# EAGLE design led (EAGLE 7.1.0)
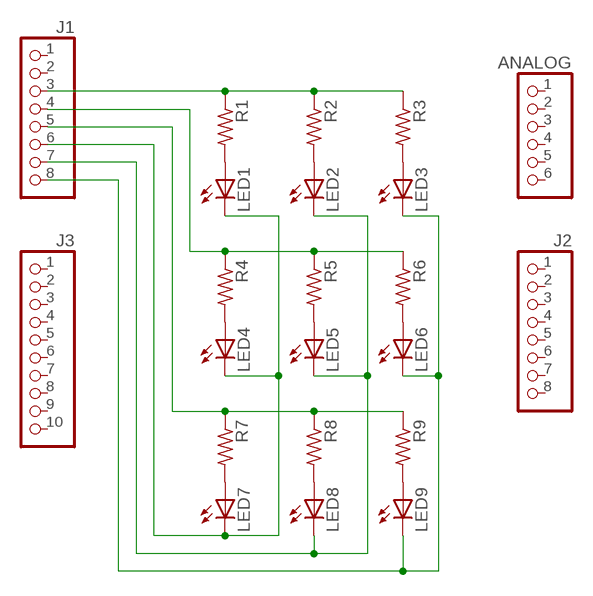
[diagram p0: schematic, sheet 1]

## Parts
ANALOG  PINHD-1X6  [1X06]
J1  PINHD-1X8TH  [1X08-TH]
J2  PINHD-1X8TH  [1X08-TH]
J3  PINHD-1X10TH  [1X10-TH]
LED1  LED3MM  [LED3MM]
LED2  LED3MM  [LED3MM]
LED3  LED3MM  [LED3MM]
LED4  LED3MM  [LED3MM]
LED5  LED3MM  [LED3MM]
LED6  LED3MM  [LED3MM]
LED7  LED3MM  [LED3MM]
LED8  LED3MM  [LED3MM]
LED9  LED3MM  [LED3MM]
R1  R-US_0207/10  [0207/10]
R2  R-US_0207/10  [0207/10]
R3  R-US_0207/10  [0207/10]
R4  R-US_0207/10  [0207/10]
R5  R-US_0207/10  [0207/10]
R6  R-US_0207/10  [0207/10]
R7  R-US_0207/10  [0207/10]
R8  R-US_0207/10  [0207/10]
R9  R-US_0207/10  [0207/10]

## Nets
N$1: LED1.A R1.2
N$2: LED2.A R2.2
N$3: LED3.A R3.2
N$4: LED4.A R4.2
N$5: LED5.A R5.2
N$6: LED6.A R6.2
N$7: LED7.A R7.2
N$8: LED8.A R8.2
N$9: LED9.A R9.2
N$10: J1.3 R1.1 R2.1 R3.1
N$14: J1.6 LED1.K(C) LED4.K(C) LED7.K(C)
N$15: J1.7 LED2.K(C) LED5.K(C) LED8.K(C)
N$16: J1.8 LED3.K(C) LED6.K(C) LED9.K(C)
N$17: J1.4 R4.1 R5.1 R6.1
N$18: J1.5 R7.1 R8.1 R9.1
Unconnected: ANALOG.1 ANALOG.2 ANALOG.3 ANALOG.4 ANALOG.5 ANALOG.6 J1.1 J1.2 J2.1 J2.2 J2.3 J2.4 J2.5 J2.6 J2.7 J2.8 J3.1 J3.2 J3.3 J3.4 J3.5 J3.6 J3.7 J3.8 J3.9 J3.10

## Library data of the parts
ANALOG = pinhead:PINHD-1X6: PIN HEADER
J1 J2 = SmartPrj:PINHD-1X8: PIN HEADER
J3 = SmartPrj:PINHD-1X10: PIN HEADER
LED1-LED9 = led:LED: LED OSRAM: - CHIPLED LG R971, LG N971, LY N971, LG Q971, LY Q971, LO R971, LY R971 LH N974, LH R974 LS Q976, LO Q976, LY Q976 LO Q996 - Hyper CHIPLED LW Q18S LB Q993, LB Q99A, LB R99A - SideLED LS A670, LO A670, LY A670, LG A670, LP A670 LB A673, LV A673, LT A673, LW A673 LH A674 LY A675 LS A676, LA A676, LO A676, LY A676, LW A676 LS A679, LY A679, LG A679 - Hyper Micro SIDELED® LS Y876, LA Y876, LO Y876, LY Y876 LT Y87S - SmartLED LW L88C, LW L88S LB L89C, LB L89S, LG L890 LS L89K, LO L89K, LY L89K LS L896, LA L896, LO L896, LY L896 - TOPLED LS T670, LO T670, LY T670, LG T670, LP T670 LSG T670, LSP T670, LSY T670, LOP T670, LYG T670 LG T671, LOG T671, LSG T671 LB T673, LV T673, LT T673, LW T673 LH T674 LS T676, LA T676, LO T676, LY T676, LB T676, LH T676, LSB T676, LW T676 LB T67C, LV T67C, LT T67C, LS T67K, LO T67K, LY T67K, LW E67C LS E67B, LA E67B, LO E67B, LY E67B, LB E67C, LV E67C, LT E67C LW T67C LS T679, LY T679, LG T679 LS T770, LO T770, LY T770, LG T770, LP T770 LB T773, LV T773, LT T773, LW T773 LH T774 LS E675, LA E675, LY E675, LS T675 LS T776, LA T776, LO T776, LY T776, LB T776 LHGB T686 LT T68C, LB T68C - Hyper Mini TOPLED® LB M676 - Mini TOPLED Santana® LG M470 LS M47K, LO M47K, LY M47K Source: http://www.osram.convergy.de LUXEON: - LUMILED® LXK2-PW12-R00, LXK2-PW12-S00, LXK2-PW14-U00, LXK2-PW14-V00 LXK2-PM12-R00, LXK2-PM12-S00, LXK2-PM14-U00 LXK2-PE12-Q00, LXK2-PE12-R00, LXK2-PE12-S00, LXK2-PE14-T00, LXK2-PE14-U00 LXK2-PB12-K00, LXK2-PB12-L00, LXK2-PB12-M00, LXK2-PB14-N00, LXK2-PB14-P00, LXK2-PB14-Q00 LXK2-PR12-L00, LXK2-PR12-M00, LXK2-PR14-Q00, LXK2-PR14-R00 LXK2-PD12-Q00, LXK2-PD12-R00, LXK2-PD12-S00 LXK2-PH12-R00, LXK2-PH12-S00 LXK2-PL12-P00, LXK2-PL12-Q00, LXK2-PL12-R00 Source: www.luxeon.com KINGBRIGHT: KA-3528ASYC Source: www.kingbright.com
R1-R9 = resistor:R-US_: RESISTOR, American symbol

## Board
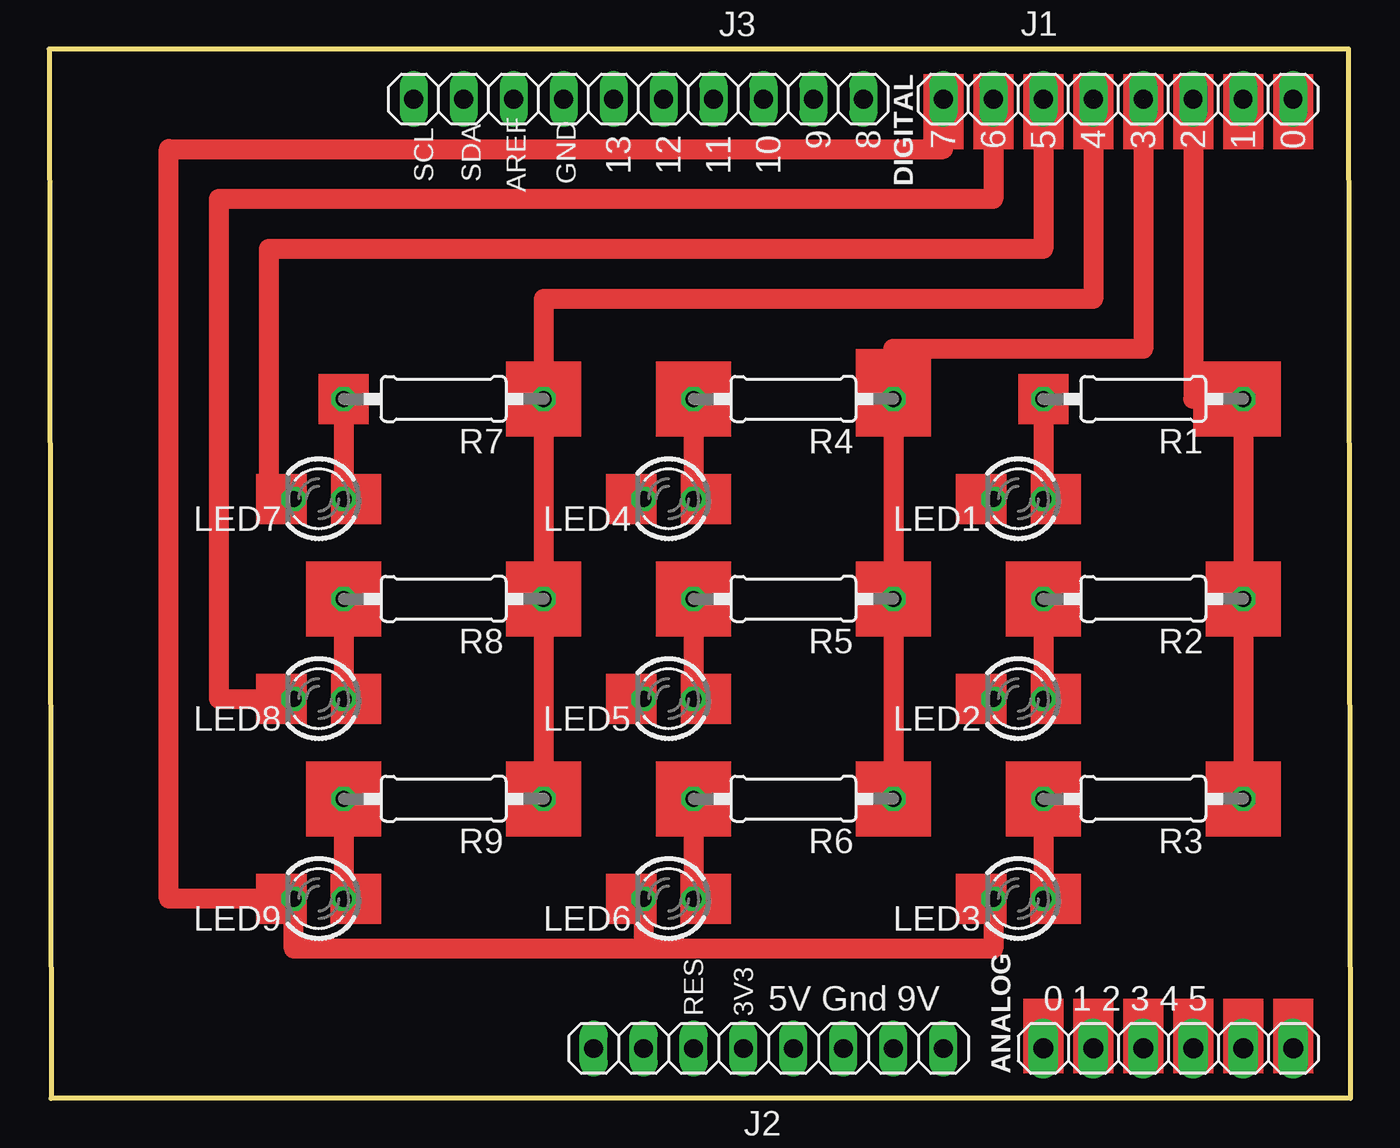
[diagram p1: board, top side]
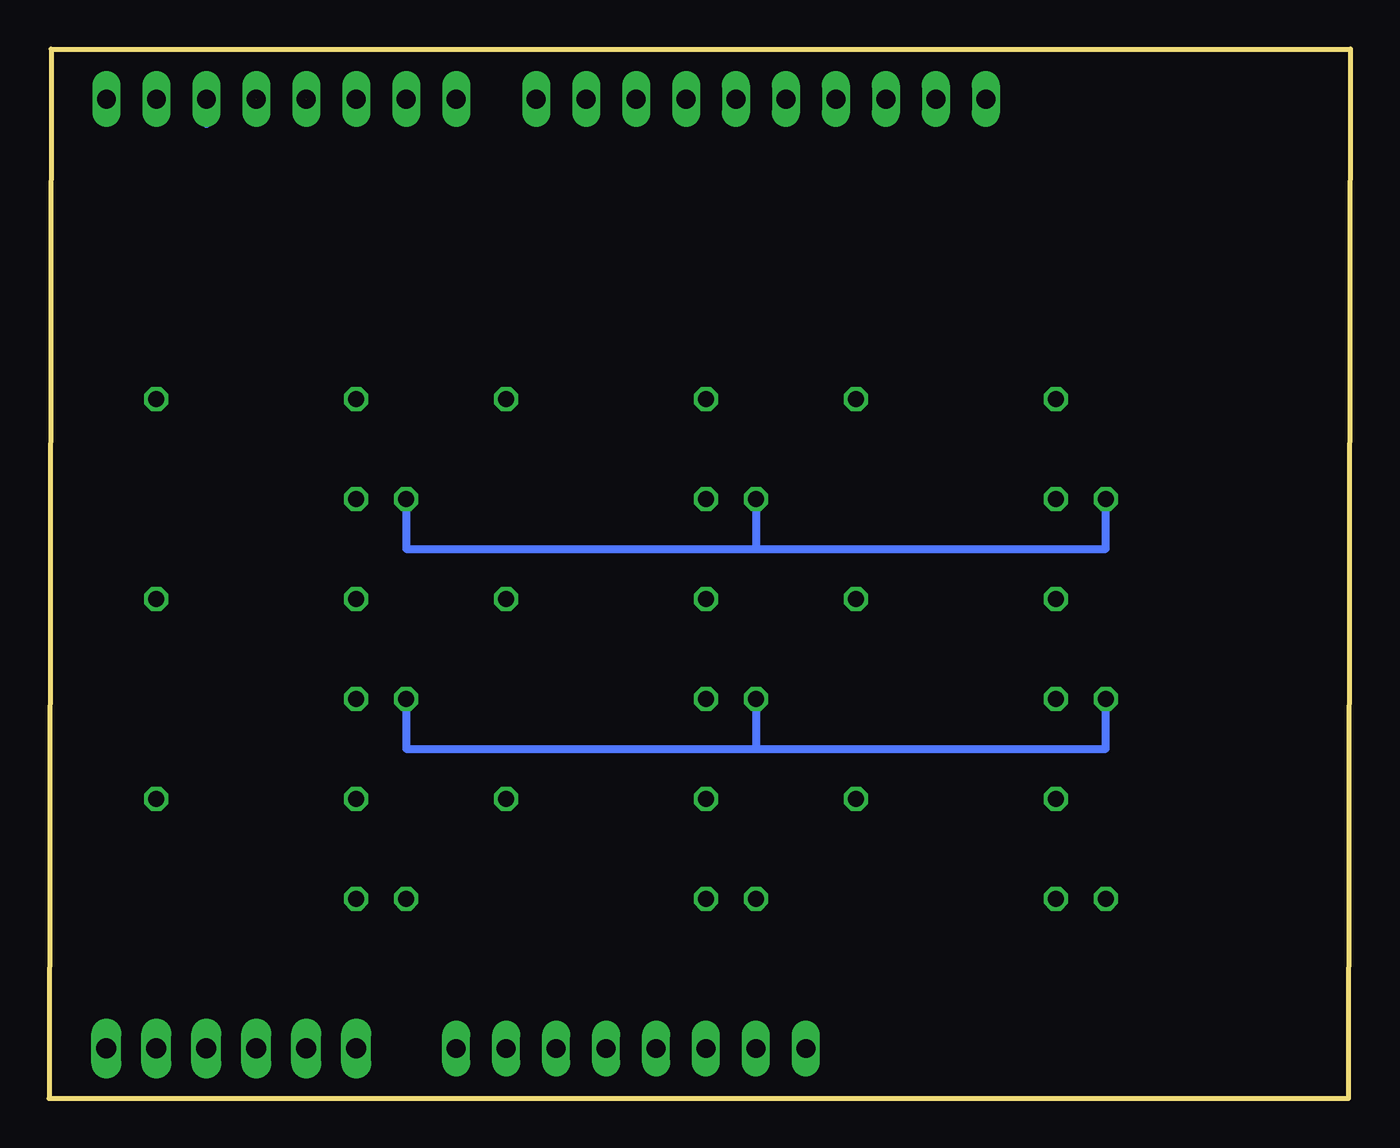
[diagram p2: board, bottom side, seen from below]

Size 66.14 x 53.34 mm. Coordinates in mm from the lower left corner, seen from the top.
Outline: 66.14,0 0.09,0 0,53.34 66.04,53.34 66.14,0
Copper layers (1*16): Top 0.035mm / dielectric 1.53mm / Bottom 0.035mm
Design rules "pban_4mil-l2": minimum track width 0.1mm, minimum drill 0.3mm, track to track 0.1mm, track to pad 0.229mm, pad to pad 0.1mm, via to via 0.1mm, smd to smd 0.1mm, copper to edge 0.5mm, drill to drill 0.5mm, minimum pad ring 0.15mm, minimum via ring 0.15mm, stop-mask expansion 4mil, vias tented up to drill 0.35mm, thermal gap 10mil

### Footprints (pad centres in the part's own frame; a part is rotated, then mirrored left to right if it is on the bottom)
1X06 = drill 1.016 long: 1 -6.35,0; 2 -3.81,0; 3 -1.27,0; 4 1.27,0; 5 3.81,0; 6 6.35,0
1X08-TH = drill 0.95 pad 1.422 long: 1 -8.89,0; 2 -6.35,0; 3 -3.81,0; 4 -1.27,0; 5 1.27,0; 6 3.81,0; 7 6.35,0; 8 8.89,0
1X10-TH = drill 0.95 pad 1.422 long: 1 -11.43,0; 2 -8.89,0; 3 -6.35,0; 4 -3.81,0; 5 -1.27,0; 6 1.27,0; 7 3.81,0; 8 6.35,0; 9 8.89,0; 10 11.43,0
LED3MM = drill 0.813 octagon: A -1.27,0; K 1.27,0
0207/10 = drill 0.813 octagon: 1 -5.08,0; 2 5.08,0

### Placement (x,y rotation side)
ANALOG  56.88,2.54 0 top
J1  54.34,50.8 180 top
J2  36.56,2.54 0 top
J3  29.96,50.8 180 top
LED1  49.26,30.48 180 top
LED2  49.26,20.32 180 top
LED3  49.26,10.16 180 top
LED4  31.48,30.48 180 top
LED5  31.48,20.32 180 top
LED6  31.48,10.16 180 top
LED7  13.7,30.48 180 top
LED8  13.7,20.32 180 top
LED9  13.7,10.16 180 top
R1  55.61,35.56 180 top
R2  55.61,25.4 180 top
R3  55.61,15.24 180 top
R4  37.83,35.56 180 top
R5  37.83,25.4 180 top
R6  37.83,15.24 180 top
R7  20.05,35.56 180 top
R8  20.05,25.4 180 top
R9  20.05,15.24 180 top

### Tracks (layer width: path | path; a pad name or v marks a point on that pad's centre or on a via)
N$1
  Top 1.016: R1.2 LED1.A
N$2
  Top 1.016: R2.2 LED2.A
N$3
  Top 1.016: R3.2 LED3.A
N$4
  Top 1.016: R4.2 LED4.A
N$5
  Top 1.016: R5.2 LED5.A
N$6
  Top 1.016: R6.2 LED6.A
N$7
  Top 1.016: R7.2 LED7.A
N$8
  Top 1.016: R8.2 LED8.A
N$9
  Top 1.016: R9.2 LED9.A
N$10
  Top 1.016: J1.3 58.15,35.56 R1.1 R2.1 R3.1
  Bottom 0.406: 58.15,49.53 J1.3
N$14
  Top 1.016: J1.6 50.53,43.18 11.16,43.18 11.16,30.48 LED7.K
  Bottom 0.406: LED1.K 47.99,27.94 30.21,27.94 | LED4.K 30.21,27.94 | 30.21,27.94 12.43,27.94 LED7.K
N$15
  Top 1.016: J1.7 47.99,45.72 8.62,45.72 8.62,20.32 LED8.K
  Bottom 0.406: LED2.K 47.99,17.78 30.21,17.78 | LED5.K 30.21,17.78 | 30.21,17.78 12.43,17.78 LED8.K
N$16
  Top 1.016: LED3.K 47.99,7.62 30.21,7.62 | LED6.K 30.21,7.62 | 30.21,7.62 12.43,7.62 LED9.K 6.08,10.16 6.08,48.26 45.45,48.26 J1.8
N$17  (1 unrouted)
  Top 1.016: J1.4 55.61,38.1 42.91,38.1 R4.1 R5.1 R6.1
N$18  (1 unrouted)
  Top 1.016: J1.5 53.07,40.64 25.13,40.64 R7.1 R8.1 R9.1
(copper drawn outside any net)
  shapes: Top area x52

### Text on the board
tPlace: 9 | 8 | 7 | 6 | 5 | 4 | 3 | 2 | 1 | 0 | 13 | 12 | 11 | 10
tNames: DIGITAL | AREF | SCL | SDA | GND | RES | 3V3 | 5V Gnd 9V | 0 1 2 3 4 5
bStop: DIGITAL | SDA | AREF | SCL | GND | 13 | 12 | 11 | 10 | 9 | 8 | 7 | 6 | 5 | 4 | 3 | 2 | 1 | 0 | ANALOG | IOREF | RST | 3.3V | 5V | GND | GND | VIN | 0 | 1 | 2 | 3 | 4 | 5 | 5